# EAGLE schematic 14140 (EAGLE 7.6.0)
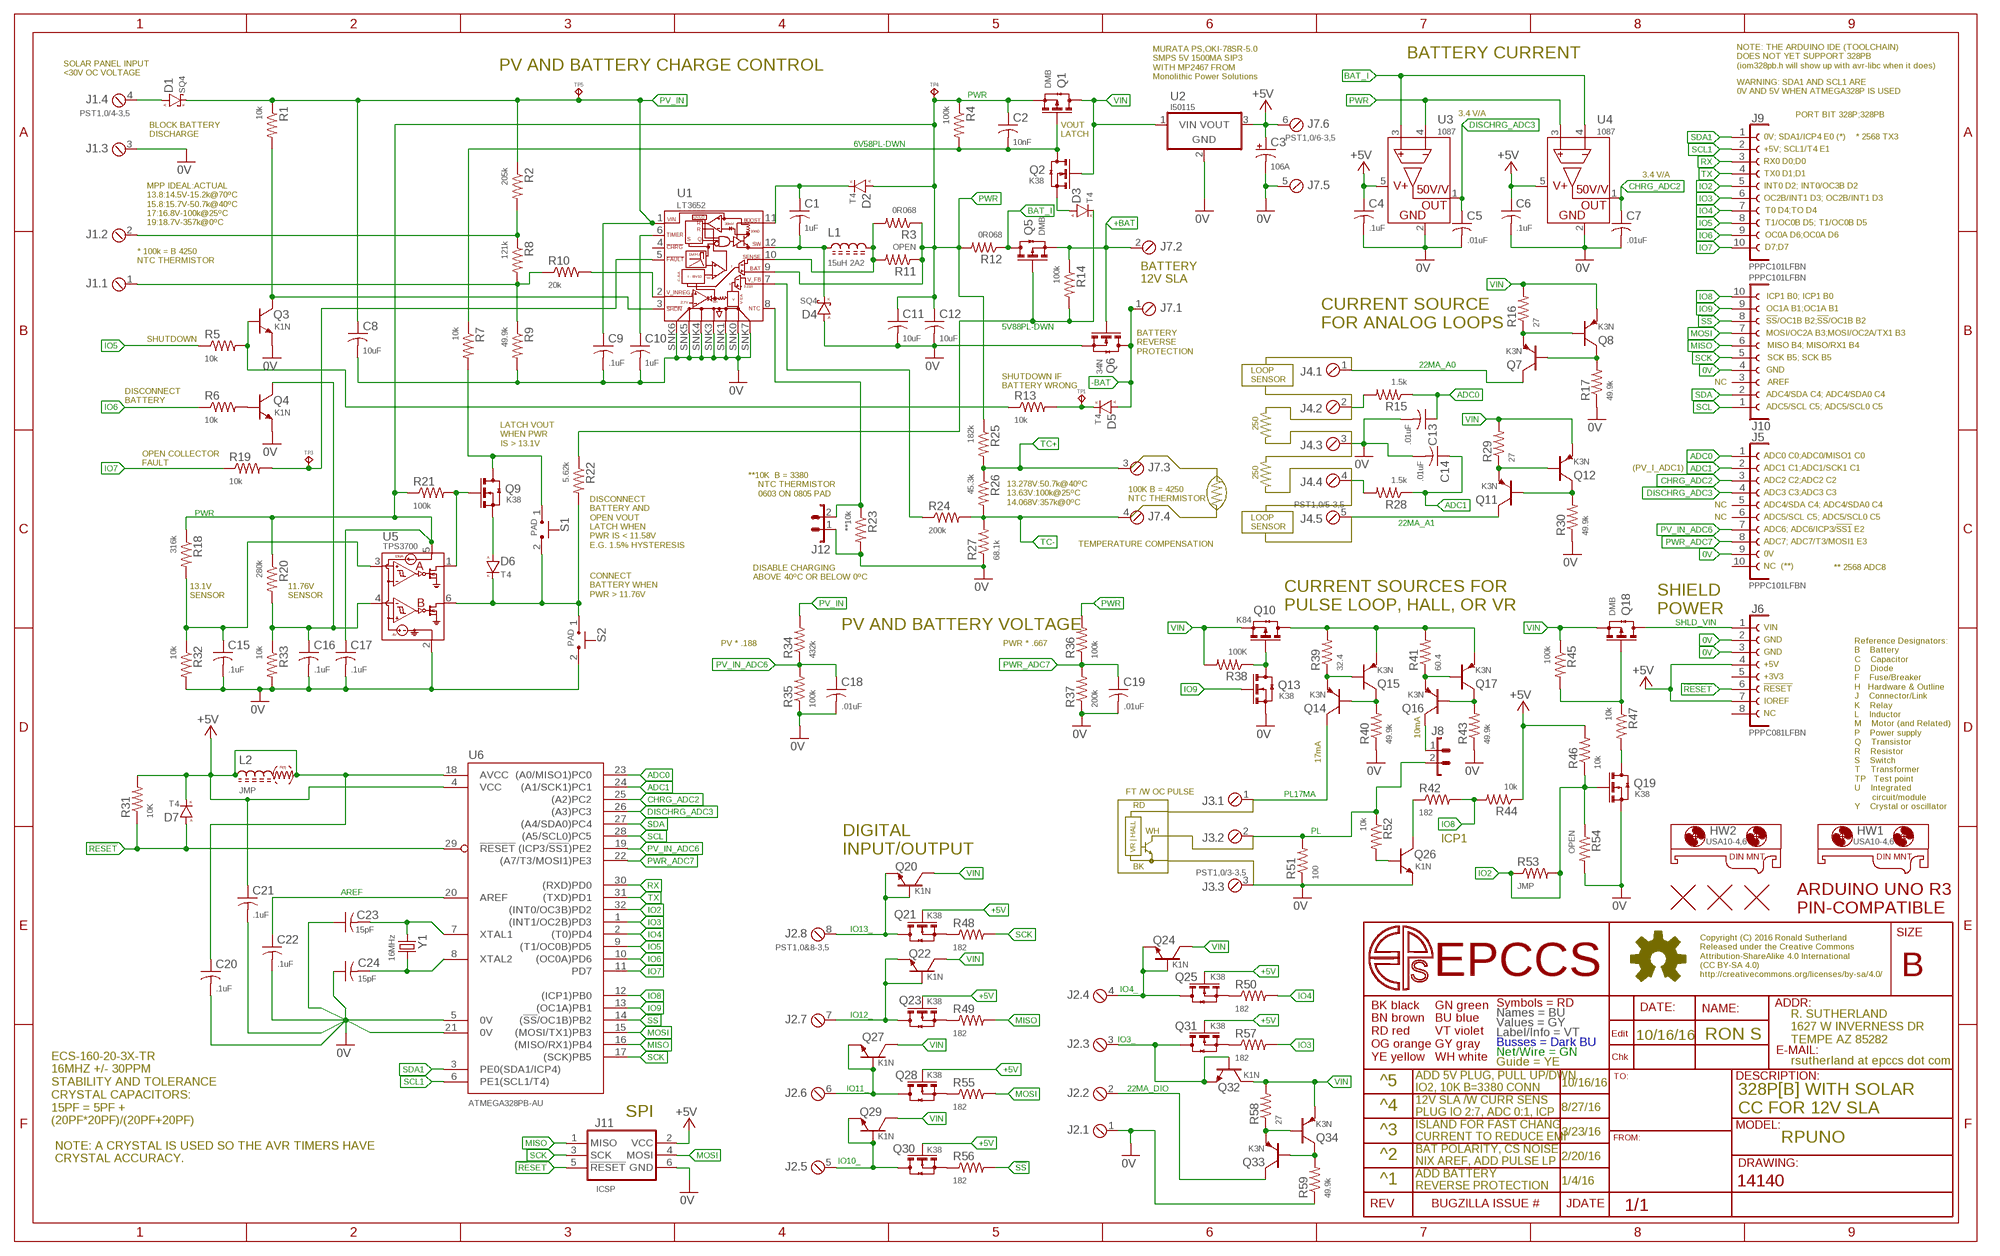
[diagram p0: schematic, sheet 1]

## Parts
C1  1uF  CC0805A  [C0805(2012)]
C2  10nF  CC0603A  [C0603(1608)]
C3  106A  CT1206  [3216]
C4  .1uF  CC0603A  [C0603(1608)]
C5  .01uF  CC0603A  [C0603(1608)]
C6  .1uF  CC0603A  [C0603(1608)]
C7  .01uF  CC0603A  [C0603(1608)]
C8  10uF  CC1206  [C1206(3216)]
C9  .1uF  CC0805A  [C0805(2012)]
C10  1uF  CC0805A  [C0805(2012)]
C11  10uF  CC1206  [C1206(3216)]
C12  10uF  CC1206  [C1206(3216)]
C13  .01uF  CC0603A  [C0603(1608)]
C14  .01uF  CC0603A  [C0603(1608)]
C15  .1uF  CC0603A  [C0603(1608)]
C16  .1uF  CC0603A  [C0603(1608)]
C17  .1uF  CC0603A  [C0603(1608)]
C18  .01uF  CC0603A  [C0603(1608)]
C19  .01uF  CC0603A  [C0603(1608)]
C20  .1uF  CC0603A  [C0603(1608)]
C21  .1uF  CC0603A  [C0603(1608)]
C22  .1uF  CC0603A  [C0603(1608)]
C23  15pF  CC0603A  [C0603(1608)]
C24  15pF  CC0603A  [C0603(1608)]
D1  SQ4  DSMA  [SMA]
D2  T4  DSOD123  [SOD123]
D3  T4  DSOD123  [SOD123]
D4  SQ4  DSMA  [SMA]
D5  T4  DSOD123  [SOD123]
D6  T4  DSOD123  [SOD123]
D7  T4  DSOD123  [SOD123]
HW1  USA10-4,6  MOUNT-HOLE5.0  [USA10]
HW2  USA10-4,6  MOUNT-HOLE5.0  [USA10]
J1  PST1,0/4-3,5  MCV4  [MCV4]
J2  PST1,0&8-3,5  MCV8  [MCV8]
J3  PST1,0/3-3,5  MCV3  [MCV3]
J4  PST1,0/5-3,5  MCV5  [MCV5]
J5  PPPC101LFBN  F1X10  [F1X10]
J6  PPPC081LFBN  F1X8  [F1X8]
J7  PST1,0/6-3,5  MCV6  [MCV6]
J8  1X2  [1X2]
J9  PPPC101LFBN  F1X10  [F1X10]
J10  PPPC101LFBN  F1X10  [F1X10]
J11  ICSP  ISP-SPIPTH  [ISP]
J12  1X2  [1X2]
L1  15uH 2A2  L3939  [L3939]
L2  JMP  L0805  [C0805(2012)]
Q1  DMB  N-CHSOT23  [SOT23]
Q2  K38  N-CHSOT23  [SOT23]
Q3  K1N  NPNSOT23  [SOT23]
Q4  K1N  NPNSOT23  [SOT23]
Q5  DMB  N-CHSOT23  [SOT23]
Q6  34N  N-CHSOT23  [SOT23]
Q7  K3N  PNPSOT23  [SOT23]
Q8  K3N  PNPSOT23  [SOT23]
Q9  K38  N-CHSOT23  [SOT23]
Q10  K84  N-CHSOT23  [SOT23]
Q11  K3N  PNPSOT23  [SOT23]
Q12  K3N  PNPSOT23  [SOT23]
Q13  K38  N-CHSOT23  [SOT23]
Q14  K3N  PNPSOT23  [SOT23]
Q15  K3N  PNPSOT23  [SOT23]
Q16  K3N  PNPSOT23  [SOT23]
Q17  K3N  PNPSOT23  [SOT23]
Q18  DMB  N-CHSOT23  [SOT23]
Q19  K38  N-CHSOT23  [SOT23]
Q20  K1N  NPNSOT23  [SOT23]
Q21  K38  N-CHSOT23  [SOT23]
Q22  K1N  NPNSOT23  [SOT23]
Q23  K38  N-CHSOT23  [SOT23]
Q24  K1N  NPNSOT23  [SOT23]
Q25  K38  N-CHSOT23  [SOT23]
Q26  K1N  NPNSOT23  [SOT23]
Q27  K1N  NPNSOT23  [SOT23]
Q28  K38  N-CHSOT23  [SOT23]
Q29  K1N  NPNSOT23  [SOT23]
Q30  K38  N-CHSOT23  [SOT23]
Q31  K38  N-CHSOT23  [SOT23]
Q32  K1N  NPNSOT23  [SOT23]
Q33  K3N  PNPSOT23  [SOT23]
Q34  K3N  PNPSOT23  [SOT23]
R1  10k  R0805  [C0805(2012)]
R2  205k  R0805  [C0805(2012)]
R3  0R068  R1210  [C1210(3225)]
R4  100k  R0805  [C0805(2012)]
R5  10k  R0805  [C0805(2012)]
R6  10k  R0805  [C0805(2012)]
R7  10k  R0805  [C0805(2012)]
R8  121k  R0805  [C0805(2012)]
R9  49.9k  R0805  [C0805(2012)]
R10  20k  R0805  [C0805(2012)]
R11  OPEN  R1210  [C1210(3225)]
R12  0R068  R1210  [C1210(3225)]
R13  10k  R0805  [C0805(2012)]
R14  100k  R0805  [C0805(2012)]
R15  1.5k  R0805  [C0805(2012)]
R16  27  R0805  [C0805(2012)]
R17  49.9k  R0805  [C0805(2012)]
R18  316k  R0805  [C0805(2012)]
R19  10k  R0805  [C0805(2012)]
R20  280k  R0805  [C0805(2012)]
R21  100k  R0805  [C0805(2012)]
R22  5.62k  R0805  [C0805(2012)]
R23  **10k  R0805  [C0805(2012)]
R24  200k  R0805  [C0805(2012)]
R25  182k  R0805  [C0805(2012)]
R26  45.3k  R0805  [C0805(2012)]
R27  68.1k  R0805  [C0805(2012)]
R28  1.5k  R0805  [C0805(2012)]
R29  27  R0805  [C0805(2012)]
R30  49.9k  R0805  [C0805(2012)]
R31  10K  R0805  [C0805(2012)]
R32  10k  R0805  [C0805(2012)]
R33  10k  R0805  [C0805(2012)]
R34  432k  R0805  [C0805(2012)]
R35  100k  R0805  [C0805(2012)]
R36  100k  R0805  [C0805(2012)]
R37  200k  R0805  [C0805(2012)]
R38  100K  R0805  [C0805(2012)]
R39  32.4  R0805  [C0805(2012)]
R40  49.9k  R0805  [C0805(2012)]
R41  60.4  R0805  [C0805(2012)]
R42  182  R0805  [C0805(2012)]
R43  49.9k  R0805  [C0805(2012)]
R44  10k  R0805  [C0805(2012)]
R45  100k  R0805  [C0805(2012)]
R46  10k  R0805  [C0805(2012)]
R47  10k  R0805  [C0805(2012)]
R48  182  R0805  [C0805(2012)]
R49  182  R0805  [C0805(2012)]
R50  182  R0805  [C0805(2012)]
R51  100  R0805  [C0805(2012)]
R52  10k  R0805  [C0805(2012)]
R53  JMP  R0805  [C0805(2012)]
R54  OPEN  R0805  [C0805(2012)]
R55  182  R0805  [C0805(2012)]
R56  182  R0805  [C0805(2012)]
R57  182  R0805  [C0805(2012)]
R58  27  R0805  [C0805(2012)]
R59  49.9k  R0805  [C0805(2012)]
S1  PAD  TAC_SWSMD  [C0805(2012)]
S2  PAD  TAC_SWSMD  [C0805(2012)]
TP1  TPPAD1-08  [P1-08]
TP3  TPPAD1-08  [P1-08]
TP4  TPPAD1-08  [P1-08]
TP5  TPPAD1-08  [P1-08]
U1  LT3652  [12MSOP-EDP-HAND]
U2  I50115  OKI-78SR-H  [OKI-78SR-H]
U3  1087  ZXCT1087  [SOT23-5]
U4  1087  ZXCT1087  [SOT23-5]
U5  TPS3700  TPS3700DDCR  [SOT23-6]
U6  ATMEGA328PB-AU  [TQFP32-08]
U$1  ARDUINO-UNO  [ARDUINO_UNO]
U$2  FIDUCIAL1.27  [FIDUCIAL-1.27]
U$3  FIDUCIAL1.27  [FIDUCIAL-1.27]
U$4  FIDUCIAL1.27  [FIDUCIAL-1.27]
Y1  16MHz  CSM-3X  [CSM-3X]

## Nets
0V: C3.- C4.2 C5.2 C6.2 C7.2 C8.2 C9.2 C10.2 C11.2 C12.2 C13.2 C14.2 C15.2 C16.2 C17.2 C18.2 C19.2 C20.2 C21.2 C22.2 C23.1 C24.1 D4.A J1.3 J2.1 J3.3 J4.3 J5.9 J6.2 J6.3 J7.5 J10.4 J11.6(GND) J12.1 Q3.E Q4.E Q6.2(S)(S) Q13.2(S)(S) Q19.2(S)(S) Q26.E R9.2 R17.1 R23.2 R27.1 R30.1 R32.2 R33.2 R35.1 R37.1 R40.1 R43.1 R51.1 R54.2 R59.1 S2.2 U1.SNK0(0V) U1.SNK1(0V) U1.SNK3(0V) U1.SNK4(0V) U1.SNK5(0V) U1.SNK6(0V) U1.SNK7(0V) U2.2(GND) U3.2(GND) U4.2(GND) U5.2(0V) U6.5(0V) U6.21(0V)
5V88PL-DWN: D3.C(K) Q5.1(G)(G) R14.2 R22.1
6V58PL-DWN: C2.2 Q1.1(G)(G) Q2.3(D)(D) R4.2 R7.1
22MA_A0: J4.1 Q7.C
22MA_A1: J4.5 Q11.C
22MA_DIO: J2.2 Q33.C
!FAULT: R19.2 TP3.TP U1.5(!FAULT)
!RESET!: D7.A J6.6 J11.5(!RESET) R31.1 U6.29(!RESET)
!SS: J10.8 R56.2 U6.14((!SS!/OC1B)PB2)
+5V: C3.+ C4.1 C6.1 C20.1 C21.1 D7.C(K) J6.4 J6.7 J7.6 J11.2(VCC) L2.1 L2.2 Q21.1(G)(G) Q23.1(G)(G) Q25.1(G)(G) Q28.1(G)(G) Q30.1(G)(G) Q31.1(G)(G) R31.2 R44.1 R46.2 U2.3(VOUT) U3.5(VCC) U4.5(VCC) U6.4(VCC) U6.18(AVCC)
+BAT: J7.2 Q5.2(S)(S) Q6.1(G)(G) R14.1
-BAT: D5.A J7.1 Q6.3(D)(D)
ADC0: C13.1 J5.1 R15.1 U6.23((A0/MISO1)PC0)
ADC1: C14.1 J5.2 R28.1 U6.24((A1/SCK1)PC1)
AREF: C22.1 U6.20(AREF)
BAT_I: Q5.3(D)(D) R12.1 U3.3(S+) U4.4(S-)
CHRG_ADC2: C7.1 J5.3 U4.1(OUT) U6.25((A2)PC2)
DISCHRG_ADC3: C5.1 J5.4 U3.1(OUT) U6.26((A3)PC3)
IO2: J9.5 Q19.1(G)(G) R46.1 R53.1 R53.2 R54.1 U6.32((INT0/OC3B)PD2)
IO3: J9.6 R57.2 U6.1((INT1/OC2B)PD3)
IO3_: J2.3 Q31.3(D)(D) Q32.B Q32.E
IO4: J9.7 R50.2 U6.2((T0)PD4)
IO4_: J2.4 Q24.B Q24.E Q25.3(D)(D)
IO5: J9.8 R5.1 U6.9((T1/OC0B)PD5)
IO6: J9.9 R6.1 U6.10((OC0A)PD6)
IO7: J9.10 R19.1 U6.11(PD7)
IO8: J10.10 R42.2 R44.2 U6.12((ICP1)PB0)
IO9: J10.9 Q13.1(G)(G) U6.13((OC1A)PB1)
IO10_: J2.5 Q29.B Q29.E Q30.3(D)(D)
IO11_: J2.6 Q27.B Q27.E Q28.3(D)(D)
IO12_: J2.7 Q22.B Q22.E Q23.3(D)(D)
IO13_: J2.8 Q20.B Q20.E Q21.3(D)(D)
MISO: J10.6 J11.1(MISO) R49.2 U6.16((MISO/RX1)PB4)
MOSI: J10.7 J11.4(MOSI) R55.2 U6.15((MOSI/TX1)PB3)
N$1: C10.1 U1.6(TIMER)
N$2: R24.1 U1.7(V_FB)
N$3: J1.1 R8.2 R9.1 R10.1
N$4: Q3.C R1.2 U1.3(!SHDN)
N$5: D1.A J1.4
N$6: Q4.B R6.2
N$7: C16.1 Q4.C R20.2 R33.1 U5.4(INB)
N$8: D3.A Q2.2(S)(S)
N$9: J1.2 R2.2 R8.1
N$10: C1.1 D2.C(K) U1.11(BOOST)
N$11: R10.2 U1.2(V_INREG)
N$12: Q10.3(D)(D) Q15.E Q17.E R39.2 R41.2
N$13: D5.C(K) R13.2 TP1.TP
N$14: D6.A Q9.2(S)(S)
N$15: C15.1 R18.2 R32.1 U5.3(INA)
N$16: Q9.1(G)(G) R21.2 U5.1(OUTA)
N$17: D6.C(K) R22.2 S1.2 S2.1 U5.6(OUTB)
N$18: Q9.3(D)(D) R7.2 S1.1
N$19: J8.1 Q16.C
N$20: Q7.E Q8.B R16.1
N$21: Q23.2(S)(S) R49.1
N$22: Q28.2(S)(S) R55.1
N$23: Q7.B Q8.C R17.2
N$24: J4.2 R15.2
N$25: Q10.1(G)(G) Q13.3(D)(D) R38.1
N$26: Q30.2(S)(S) R56.1
N$27: J4.4 R28.2
N$28: Q11.E Q12.B R29.1
N$29: Q11.B Q12.C R30.2
N$30: Q33.E Q34.B R58.1
N$31: Q31.2(S)(S) R57.1
N$32: Q25.2(S)(S) R50.1
N$33: Q33.B Q34.C R59.2
N$34: Q21.2(S)(S) R48.1
N$35: Q18.1(G)(G) R45.2 R47.1
N$37: Q19.3(D)(D) R47.2
N$46: Q3.B R5.2 R13.1
N$107: Q26.B R52.2
N$108: Q26.C R42.1
N$114: Q14.E Q15.B R39.1
N$115: C23.2 U6.7(XTAL1) Y1.1
N$116: C24.2 U6.8(XTAL2) Y1.2
N$119: Q14.B Q15.C R40.2
N$122: Q16.E Q17.B R41.1
N$123: Q16.B Q17.C R43.2
NTC1: J12.2 R23.1 U1.8(NTC)
PL: J3.2 J8.2 R51.2 R52.1
PL17MA: J3.1 Q14.C
PV_IN: C8.1 C9.1 D1.K R1.1 R2.1 R34.2 TP5.TP U1.1(VIN)
PV_IN_ADC6: C18.1 J5.7 R34.1 R35.2 U6.19((ICP3/!SS1!)PE2)
PWR: C2.1 C11.1 C12.1 C17.1 D2.A Q1.2(S)(S) R3.1 R4.1 R11.1 R12.2 R18.1 R20.1 R21.1 R25.1 R36.2 TP4.TP U1.9(BAT) U3.4(S-) U4.3(S+) U5.5(VDD)
PWR_ADC7: C19.1 J5.8 R36.1 R37.2 U6.22((A7/T3/MOSI1)PE3)
RX: J9.3 U6.30((RXD)PD0)
SCK: J10.5 J11.3(SCK) R48.2 U6.17((SCK)PB5)
SCL: J10.1 U6.28((A5/SCL0)PC5)
SCL1: J9.2 U6.6(PE1(SCL1/T4))
SDA: J10.2 U6.27((A4/SDA0)PC4)
SDA1: J9.1 U6.3(PE0(SDA1/ICP4))
SENSE: L1.2 R3.2 R11.2 U1.10(SENSE)
SHLD_VIN: J6.1 Q18.3(D)(D)
SW: C1.2 D4.K L1.1 U1.12(SW)
TC+: J7.3 R25.2 R26.1
TC-: J7.4 R24.2 R26.2 R27.2
TX: J9.4 U6.31((TXD)PD1)
VIN: Q1.3(D)(D) Q2.1(G)(G) Q8.E Q10.2(S)(S) Q12.E Q18.2(S)(S) Q20.C Q22.C Q24.C Q27.C Q29.C Q32.C Q34.E R16.2 R29.2 R38.2 R45.1 R58.2 U2.1(VIN)
Unconnected: J5.5 J5.6 J5.10 J6.5 J6.8 J10.3 U1.4(!CHRG)

## Notes on the sheet
- BATTERY CURRENT
- NOTE: THE ARDUINO IDE (TOOLCHAIN)
  DOES NOT YET SUPPORT 328PB
  (iom328pb.h will show up with avr-libc when it does)
- PV AND BATTERY CHARGE CONTROL
- SOLAR PANEL INPUT
  <30V OC VOLTAGE
- MURATA PS,OKI-78SR-5.0
  SMPS 5V 1500MA SIP3
  WITH MP2467 FROM 
  Monolithic Power Solutions
- WARNING: SDA1 AND SCL1 ARE 
  0V AND 5V WHEN ATMEGA328P IS USED
- 3.4 V/A | PORT BIT 328P;328PB
- BLOCK BATTERY
  DISCHARGE
- VOUT 
  LATCH
- 0V; SDA1/ICP4 E0 (*) | * 2568 TX3
- +5V; SCL1/T4 E1
- RX0 D0;D0
- 3.4 V/A | TX0 D1;D1
- INT0 D2; INT0/OC3B D2
- OC2B/INT1 D3; OC2B/INT1 D3
- T0 D4;TO D4
- MPP IDEAL:ACTUAL
  13.8:14.5V-15.2k@70ºC
  15.8:15.7V-50.7k@40ºC
  17:16.8V-100k@25ºC
  19:18.7V-357k@0ºC
- T1/OC0B D5; T1/OC0B D5
- OC0A D6;OC0A D6
- D7;D7
- * 100k = B 4250
  NTC THERMISTOR
- BATTERY
  12V SLA
- ICP1 B0; ICP1 B0
- OC1A B1;OC1A B1
- !SS!/OC1B B2;!SS!/OC1B B2
- CURRENT SOURCE
  FOR ANALOG LOOPS
- MOSI/OC2A B3;MOSI/OC2A/TX1 B3
- SHUTDOWN
- MISO B4; MISO/RX1 B4
- BATTERY
  REVERSE 
  PROTECTION
- SCK B5; SCK B5
- GND
- LOOP 
  SENSOR
- NC | AREF
- SHUTDOWN IF
  BATTERY WRONG
- ADC4/SDA C4; ADC4/SDA0 C4
- DISCONNECT 
  BATTERY
- ADC5/SCL C5; ADC5/SCL0 C5
- 250
- LATCH VOUT
  WHEN PWR 
  IS > 13.1V
- ADC0 C0;ADC0/MISO1 C0
- OPEN COLLECTOR
  FAULT
- (PV_I_ADC1) | ADC1 C1;ADC1/SCK1 C1
- 250
- ADC2 C2;ADC2 C2
- ADC3 C3;ADC3 C3
- **10K  B = 3380
      NTC THERMISTOR
      0603 ON 0805 PAD
- 100K B = 4250
  NTC THERMISTOR
- 13.278V:50.7k@40ºC 
  13.63V:100k@25ºC
  14.068V:357k@0ºC
- NC | ADC4/SDA C4; ADC4/SDA0 C4
- NC | ADC5/SCL C5; ADC5/SCL0 C5
- LOOP 
  SENSOR
- ADC6; ADC6/ICP3/!SS1! E2
- TEMPERATURE COMPENSATION | ADC7; ADC7/T3/MOSI1 E3
- DISCONNECT 
  BATTERY AND 
  OPEN VOUT 
  LATCH WHEN 
  PWR IS < 11.58V
  E.G. 1.5% HYSTERESIS
- 0V
- NC  (**) | ** 2568 ADC8
- DISABLE CHARGING
  ABOVE 40ºC OR BELOW 0ºC
- CONNECT 
  BATTERY WHEN
  PWR > 11.76V
- 13.1V
  SENSOR
- 11.76V 
  SENSOR
- CURRENT SOURCES FOR
  PULSE LOOP, HALL, OR VR
- SHIELD
  POWER
- PV AND BATTERY VOLTAGE | VIN
- GND
- PV * .188 | PWR * .667
- GND
- +5V
- +3V3
- !RESET
- IOREF
- NC
- 10mA
- 17mA
- FT /W OC PULSE
- RD
- WH
- ICP1
- VR | HALL
- DIGITAL
  INPUT/OUTPUT
- BK
- 10/16/16 | RON S
- ^5 | 10/16/16
- ADD 5V PLUG, PULL UP/DWN 
  IO2, 10K B=3380 CONN
- ^4 | 8/27/16
- 328P[B] WITH SOLAR 
  CC FOR 12V SLA
- 12V SLA /W CURR SENS
  PLUG IO 2:7, ADC 0:1, ICP
- SPI
- ECS-160-20-3X-TR
  16MHZ +/- 30PPM
  STABILITY AND TOLERANCE
  CRYSTAL CAPACITORS:
  15PF = 5PF +
  (20PF*20PF)/(20PF+20PF)
- ^3 | 3/23/16
- ISLAND FOR FAST CHANG
  CURRENT TO REDUCE EMI
- RPUNO
- ^2 | 2/20/16
- NOTE: A CRYSTAL IS USED SO THE AVR TIMERS HAVE 
  CRYSTAL ACCURACY.
- BAT POLARITY, CS NOISE
  NIX AREF, ADD PULSE LP
- ^1 | 1/4/16
- ADD BATTERY 
  REVERSE PROTECTION

## Library data of the parts
C1 C2 C4-C24 = C-C:C: CAPACITOR Symbol
C3 = C-T:CT: Tantalum Electrolytic Capacitor
D1 D4 = D-SBR:D: DIODE
D2 D3 D5-D7 = D-GP:D: DIODE
HW1 HW2 = HW-DINMnt:MOUNT-HOLE: USA10-4.6 [PhxCont,1202713] DINRAIL ADAPTER UNIVERSAL 10MM 4.6MM
J1 = J-HDR3.5mm:MCV4: MCV 1,5/4-G-3,5-RN [PHOENIX CONTACT,1843622] CONN HEADER SHROUDED 2POS 3.5MM PST 1,0/4-3,5 [PHOENIX CONTACT,1945119] CONN HEADER STRIP PIN 4POS 3.5MM MCVR 1,5& 4-ST-3,5 [PHOENIX CONTACT,1863178] CONN PLUG 4POS SCREW 3.5MM
J2 = J-HDR3.5mm:MCV8: MC1,5&8-G-3,5 [PHOENIX CONTACT,1844278] CONN HEADER SHROUDED 8POS 3.5MM MCV1,5&8-G-3,5 [PHOENIX CONTACT,1843664] CONN HEADER SHROUDED 8POS 3.5MM MCVR1,5&8-ST-3,5 [PHOENIX CONTACT,1863217] CONN PLUG 8POS SCREW 3.5MM
J3 = J-HDR3.5mm:MCV3: MCV 1,5/ 3-G-3,5-RN [PHOENIX CONTACT,1731484] CONN HEADER SHROUDED 3POS 3.5MM MCVR 1,5/ 3-ST-3,5 [PHOENIX CONTACT,1863165] CONN PLUG 3POS SCREW 3.5MM PST 1,0/3-3,5 [PHOENIX CONTACT,1945106] CONN HEADER STRIP PIN 3POS 3.5MM PT1,5&3-PVH-3,5 [PHOENIX CONTACT,1984028] CONN PLUG STRIP 3POS 3.5MM
J4 = J-HDR3.5mm:MCV5: MCV 1,5/5-G-3,5-RN [PHOENIX CONTACT,1843635] CONN HEADER SHROUDED 5POS 3.5MM MCVR 1,5/5-ST-3,5 [PHOENIX CONTACT,1863181] CONN PLUG 5POS SCREW 3.5MM PST 1,0/5-3,5 [PHOENIX CONTACT,1945122] CONN HEADER STRIP PIN 5POS 3.5MM PT 1,5/5-PVH-3,5 [PHOENIX CONTACT,1984044] CONN PLUG STRIP 4POS 3.5MM Drill Size 3/64": .0469" (1.2mm)
J5 J9 J10 = J-HDR2.54mm:F1X10: FEMALE HEADER 10POS
J6 = J-HDR2.54mm:F1X8: FEMALE HEADER 8POS
J7 = J-HDR3.5mm:MCV6: MCV 1,5/6-G-3,5 [PHOENIX CONTACT,1843648] CONN HEADER SHROUDED 6POS 3.5MM MCVR 1,5/6-ST-3,5 [PHOENIX CONTACT,1863194] CONN PLUG 6POS SCREW 3.5MM PST 1,0/6-3,5 [PHOENIX CONTACT,1945135] CONN HEADER STRIP PIN 6POS 3.5MM PT 1,5/6-PVH-3,5 [PHOENIX CONTACT,1984057] CONN PLUG STRIP 6POS 3.5MM Drill Size 3/64": .0469" (1.2mm)
J8 J12 = J-HDR2.54mm:1X2
J11 = U-AVR:ISP-SPI: AVR ISP thru SPI In-System Programming uses the target Atmel AVR’s internal SPI (Serial Peripheral Interface) to download code into the flash and EEPROM memories. It is not a debugging interface. When designing an application PCB which includes an AVR with the SPI interface, this pinout should be used. Sparkfun SKU: BOB-08508
L1 = L-PSMD:L: Inductor
L2 = L-FB:L: Ferrite Bead with frequency dependent resistance
Q1 Q5 Q10 Q18 = Q-PCH:N-CH?*: ENHANCEMENT MODE MOSFET SOT23 is BSS138 pinout
Q2 Q6 Q9 Q13 Q19 Q21 Q23 Q25 Q28 Q30 Q31 = Q-NCH:N-CH?*: ENHANCEMENT MODE MOSFET SOT23 is BSS138 pinout
Q3 Q4 Q20 Q22 Q24 Q26 Q27 Q29 Q32 = Q-NPN:NPN: BJT NPN General Purpose Amplifier
Q7 Q8 Q11 Q12 Q14-Q17 Q33 Q34 = Q-PNP:PNP: BJT NPN General Purpose Amplifier
R1-R59 = R-C:R: Resiistor American-style symbol
S1 S2 = S-Tactile:TAC_SW: KS11 [C&K,KS11R21CQE] SWITCH PUSHBUTTON SPST-NO 25MA 50V PAD 0805
TP1 TP3-TP5 = J-TP:TP: Test pad
U1 = U-BUCK:LT3652: 3652 [LINEAR,LT3652EMSE] BUCK BATT CHARGE CONTROLLER 12MSOP
U2 = P-DCDC:OKI-78SR: OKI-78SR OKI-78SR-5/1.5-W36H-C 5V@1.5A Horizontal Mount OKI-78SR-5/1.5-W36-C 5V@1.5A Vert Mount OKI-78SR-3.3/1.5-W36H-C 3.3V@1.5A Horizontal Mount OKI-78SR-3.3/1.5-W36-C 3.3V@1.5A Vert Mount Murata Power Solutions 7 to 36 VDC input range need to verify pinout
U3 U4 = U-Linear:ZXCT1087: 1087 [DIODES,ZXCT1087E5TA] HISIDE CURRENT MONITOR SOT23-5
U5 = U-Linear:TPS3700: PXVQ [TI,TPS3700DDCR] WINDOW COMPARATOR 6SOT
U6 = U-AVR:ATMEGA328PB-AU: ATmega328PB 4 Kbytes FLASH 128 bytes SRAM 256 bytes EEPROM 2 UART, 2 I2C, 2 SPI 8-channel 10 bit ADC
U$1 = J-BoardHDR:ARDUINO-UNO: Board Outline with holes and silk note the board dim layer is not defined
U$2-U$4 = H-Fiducial:FIDUCIAL: Fiducial Alignment Points Various fiducial points for machine vision alignment.
Y1 = Y-XTL:CSM: 16MHZ20 [ECS,ECS-160-20-3X-TR] CRYSTAL 16MHZ 20PF 30PPM CSM-3X

## Net classes
0 default: width 0.254 mm, drill 0.33 mm